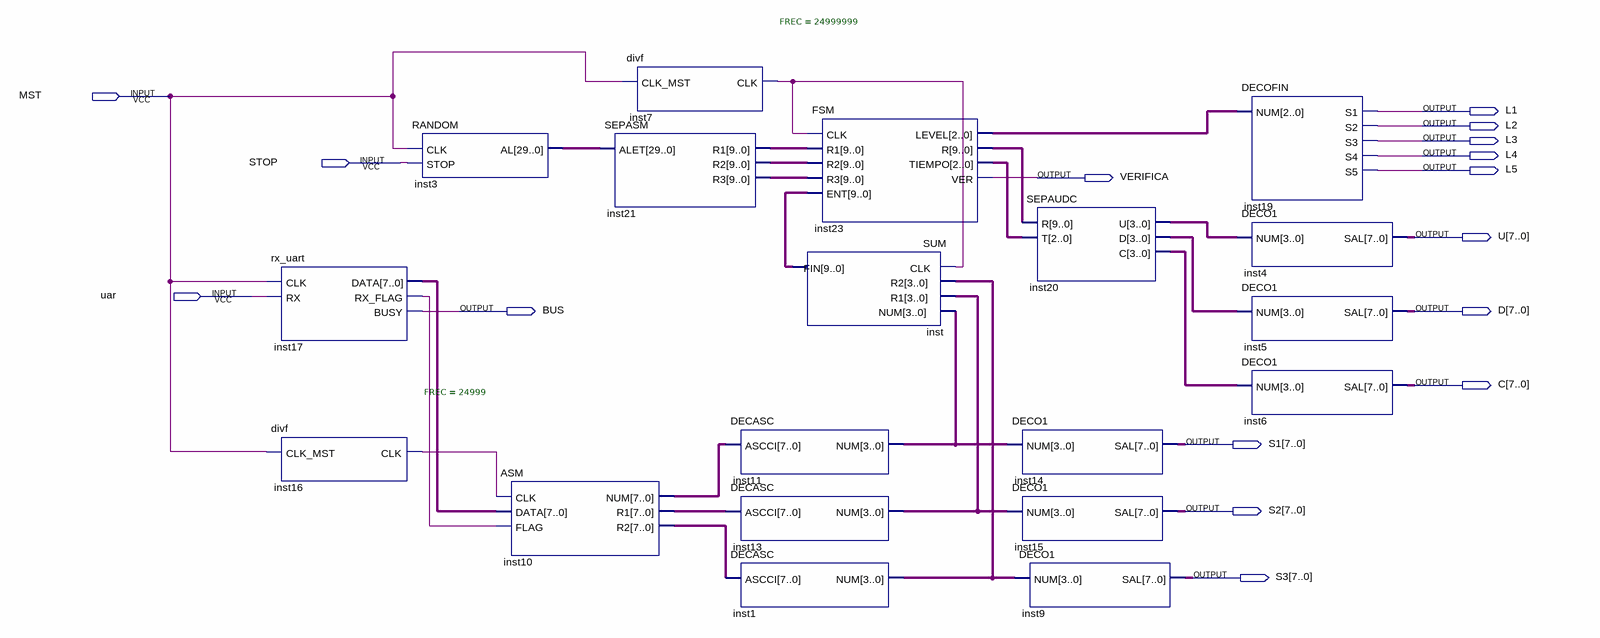
[diagram p0: schematic sheet]
// Quartus schematic AEX.bdf as structural Verilog: 19 symbols, 16 pins
module AEX (
  input  MST,
  input  STOP,
  input  uar,
  output L1,
  output L2,
  output L3,
  output L4,
  output L5,
  output VERIFICA,
  output [7:0] U,
  output BUS,
  output [7:0] D,
  output [7:0] C,
  output [7:0] S1,
  output [7:0] S2,
  output [7:0] S3
);

  wire inst7_clk, inst16_clk, inst17_rx_flag;
  wire [2:0] inst23_level, inst23_tiempo;
  wire [3:0] inst1_num, inst11_num, inst13_num, inst20_c, inst20_d, inst20_u;
  wire [7:0] inst10_num, inst10_r1, inst10_r2, inst17_data;
  wire [9:0] inst21_r1, inst21_r2, inst21_r3, inst23_r, inst_fin;
  wire [29:0] inst3_al;

  rx_uart inst17 (.CLK(MST), .RX(uar), .DATA(inst17_data), .RX_FLAG(inst17_rx_flag), .BUSY(BUS));
  divf #(.FREC(24999)) inst16 (.CLK_MST(MST), .CLK(inst16_clk));
  RANDOM inst3 (.CLK(MST), .STOP(STOP), .AL(inst3_al));
  ASM inst10 (
    .CLK(inst16_clk), .DATA(inst17_data), .FLAG(inst17_rx_flag), .NUM(inst10_num), .R1(inst10_r1),
    .R2(inst10_r2));
  SEPASM inst21 (.ALET(inst3_al), .R1(inst21_r1), .R2(inst21_r2), .R3(inst21_r3));
  divf #(.FREC(24999999)) inst7 (.CLK_MST(MST), .CLK(inst7_clk));
  DECASC inst11 (.ASCCI(inst10_num), .NUM(inst11_num));
  DECASC inst13 (.ASCCI(inst10_r1), .NUM(inst13_num));
  DECASC inst1 (.ASCCI(inst10_r2), .NUM(inst1_num));
  FSM inst23 (
    .CLK(inst7_clk), .R1(inst21_r1), .R2(inst21_r2), .R3(inst21_r3), .ENT(inst_fin), .LEVEL(inst23_level),
    .R(inst23_r), .TIEMPO(inst23_tiempo), .VER(VERIFICA));
  SUM inst (.CLK(inst7_clk), .R2(inst1_num), .R1(inst13_num), .NUM(inst11_num), .FIN(inst_fin));
  DECO1 inst14 (.NUM(inst11_num), .SAL(S1));
  DECO1 inst15 (.NUM(inst13_num), .SAL(S2));
  DECO1 inst9 (.NUM(inst1_num), .SAL(S3));
  SEPAUDC inst20 (.R(inst23_r), .T(inst23_tiempo), .U(inst20_u), .D(inst20_d), .C(inst20_c));
  DECOFIN inst19 (.NUM(inst23_level), .S1(L1), .S2(L2), .S3(L3), .S4(L4), .S5(L5));
  DECO1 inst4 (.NUM(inst20_u), .SAL(U));
  DECO1 inst5 (.NUM(inst20_d), .SAL(D));
  DECO1 inst6 (.NUM(inst20_c), .SAL(C));
endmodule
